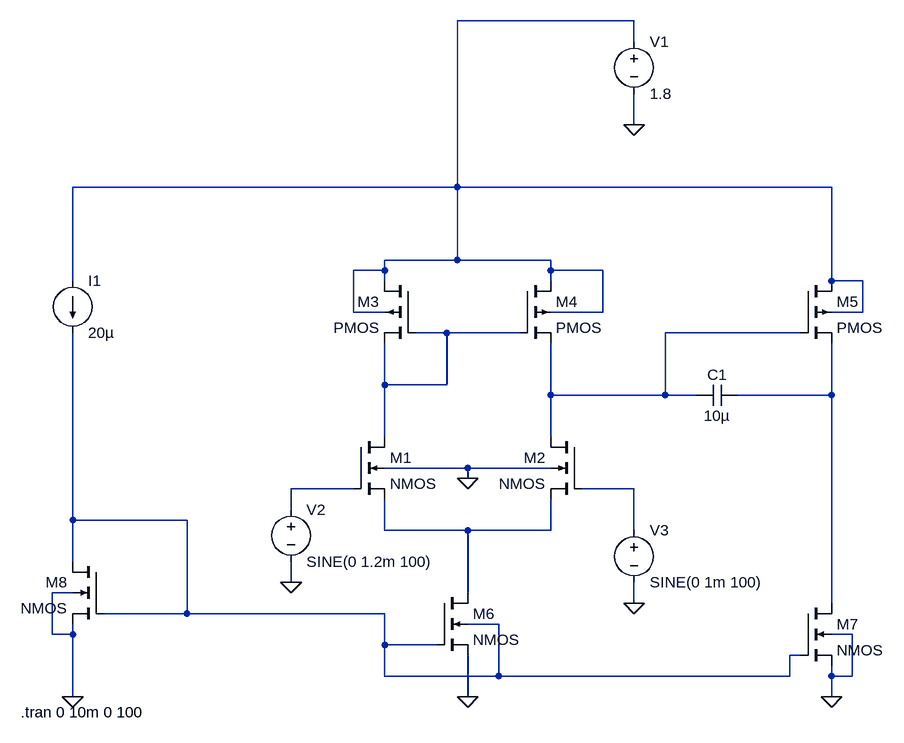
[diagram p0: schematic two_stage.asc]
two_stage.asc, the LTspice schematic file:
Version 4
SHEET 1 880 680
WIRE 480 -432 208 -432
WIRE 480 -400 480 -432
WIRE 480 -272 480 -320
WIRE 208 -176 208 -432
WIRE 208 -176 -384 -176
WIRE 784 -176 208 -176
WIRE 208 -64 208 -176
WIRE 208 -64 96 -64
WIRE 352 -64 208 -64
WIRE 96 -48 96 -64
WIRE 96 -48 48 -48
WIRE 352 -48 352 -64
WIRE 432 -48 352 -48
WIRE -384 -32 -384 -176
WIRE 96 -32 96 -48
WIRE 352 -32 352 -48
WIRE 784 -32 784 -176
WIRE 832 -32 784 -32
WIRE 48 16 48 -48
WIRE 96 16 48 16
WIRE 432 16 432 -48
WIRE 432 16 352 16
WIRE 832 16 832 -32
WIRE 832 16 784 16
WIRE 192 48 144 48
WIRE 304 48 192 48
WIRE 736 48 528 48
WIRE 96 128 96 64
WIRE 192 128 192 48
WIRE 192 128 96 128
WIRE 352 144 352 64
WIRE 528 144 528 48
WIRE 528 144 352 144
WIRE 576 144 528 144
WIRE 784 144 784 64
WIRE 784 144 640 144
WIRE 96 208 96 128
WIRE 352 208 352 144
WIRE 224 256 96 256
WIRE 352 256 224 256
WIRE 224 272 224 256
WIRE 48 288 -48 288
WIRE 480 288 400 288
WIRE -48 320 -48 288
WIRE -384 336 -384 48
WIRE -208 336 -384 336
WIRE 96 352 96 304
WIRE 224 352 96 352
WIRE 352 352 352 304
WIRE 352 352 224 352
WIRE 480 352 480 288
WIRE -384 400 -384 336
WIRE -48 432 -48 400
WIRE -384 448 -416 448
WIRE 224 448 224 352
WIRE 480 464 480 432
WIRE 784 464 784 144
WIRE -208 480 -208 336
WIRE -208 480 -336 480
WIRE 96 480 -208 480
WIRE 272 496 224 496
WIRE -416 512 -416 448
WIRE -384 512 -384 496
WIRE -384 512 -416 512
WIRE 816 512 784 512
WIRE 96 528 96 480
WIRE 176 528 96 528
WIRE 736 544 720 544
WIRE 96 576 96 528
WIRE 272 576 272 496
WIRE 272 576 96 576
WIRE 720 576 720 544
WIRE 720 576 272 576
WIRE 784 576 784 560
WIRE 816 576 816 512
WIRE 816 576 784 576
WIRE -384 608 -384 512
WIRE 224 608 224 544
WIRE 784 608 784 576
FLAG 224 608 0
FLAG -384 608 0
FLAG 784 608 0
FLAG 480 -272 0
FLAG 224 272 0
FLAG -48 432 0
FLAG 480 464 0
SYMBOL current -384 -32 R0
WINDOW 123 0 0 Left 2
WINDOW 39 0 0 Left 2
SYMATTR InstName I1
SYMATTR Value 20µ
SYMBOL voltage 480 -416 R0
WINDOW 123 0 0 Left 2
WINDOW 39 0 0 Left 2
SYMATTR InstName V1
SYMATTR Value 1.8
SYMBOL cap 640 128 R90
WINDOW 0 0 32 VBottom 2
WINDOW 3 32 32 VTop 2
SYMATTR InstName C1
SYMATTR Value 10µ
SYMBOL nmos4 48 208 R0
SYMATTR InstName M1
SYMATTR Value2 l=1u w=20u
SYMBOL nmos4 400 208 M0
SYMATTR InstName M2
SYMATTR Value2 l=1u w=20u
SYMBOL pmos4 144 -32 M0
SYMATTR InstName M3
SYMATTR Value2 l=5u w=10u
SYMBOL pmos4 304 -32 R0
SYMATTR InstName M4
SYMATTR Value2 l=5u w=10u
SYMBOL pmos4 736 -32 R0
SYMATTR InstName M5
SYMATTR Value2 l=5u w=10u
SYMBOL nmos4 176 448 R0
SYMATTR InstName M6
SYMATTR Value2 l=2u w=20u
SYMBOL nmos4 736 464 R0
SYMATTR InstName M7
SYMATTR Value2 l=2u w=20u
SYMBOL nmos4 -336 400 M0
SYMATTR InstName M8
SYMATTR Value2 l=2u w=20u
SYMBOL voltage -48 304 R0
WINDOW 123 0 0 Left 2
WINDOW 39 0 0 Left 2
SYMATTR InstName V2
SYMATTR Value SINE(0 1.2m 100)
SYMBOL voltage 480 336 R0
WINDOW 123 0 0 Left 2
WINDOW 39 0 0 Left 2
SYMATTR InstName V3
SYMATTR Value SINE(0 1m 100)
TEXT -464 632 Left 2 !.tran 0 10m 0 100

The netlist it stands for:
* two_stage.asc
I1 N001 N007 20µ
V1 N001 0 1.8
C1 N004 N003 10µ
M1 N002 N005 N008 0 NMOS l=1u w=20u
M2 N003 N006 N008 0 NMOS l=1u w=20u
M3 N001 N002 N002 N001 PMOS l=5u w=10u
M4 N001 N002 N003 N001 PMOS l=5u w=10u
M5 N001 N003 N004 N001 PMOS l=5u w=10u
M6 N008 N007 0 N007 NMOS l=2u w=20u
M7 N004 N007 0 0 NMOS l=2u w=20u
M8 N007 N007 0 0 NMOS l=2u w=20u
V2 N005 0 SINE(0 1.2m 100)
V3 N006 0 SINE(0 1m 100)
.model NMOS NMOS
.model PMOS PMOS
.lib standard.mos
.tran 0 10m 0 100
.backanno
.end